# Altium schematic sheet INA226 Current Sensor.SchDoc: INA381A Overcurrent Protection
size Letter; SheetNumber: 21
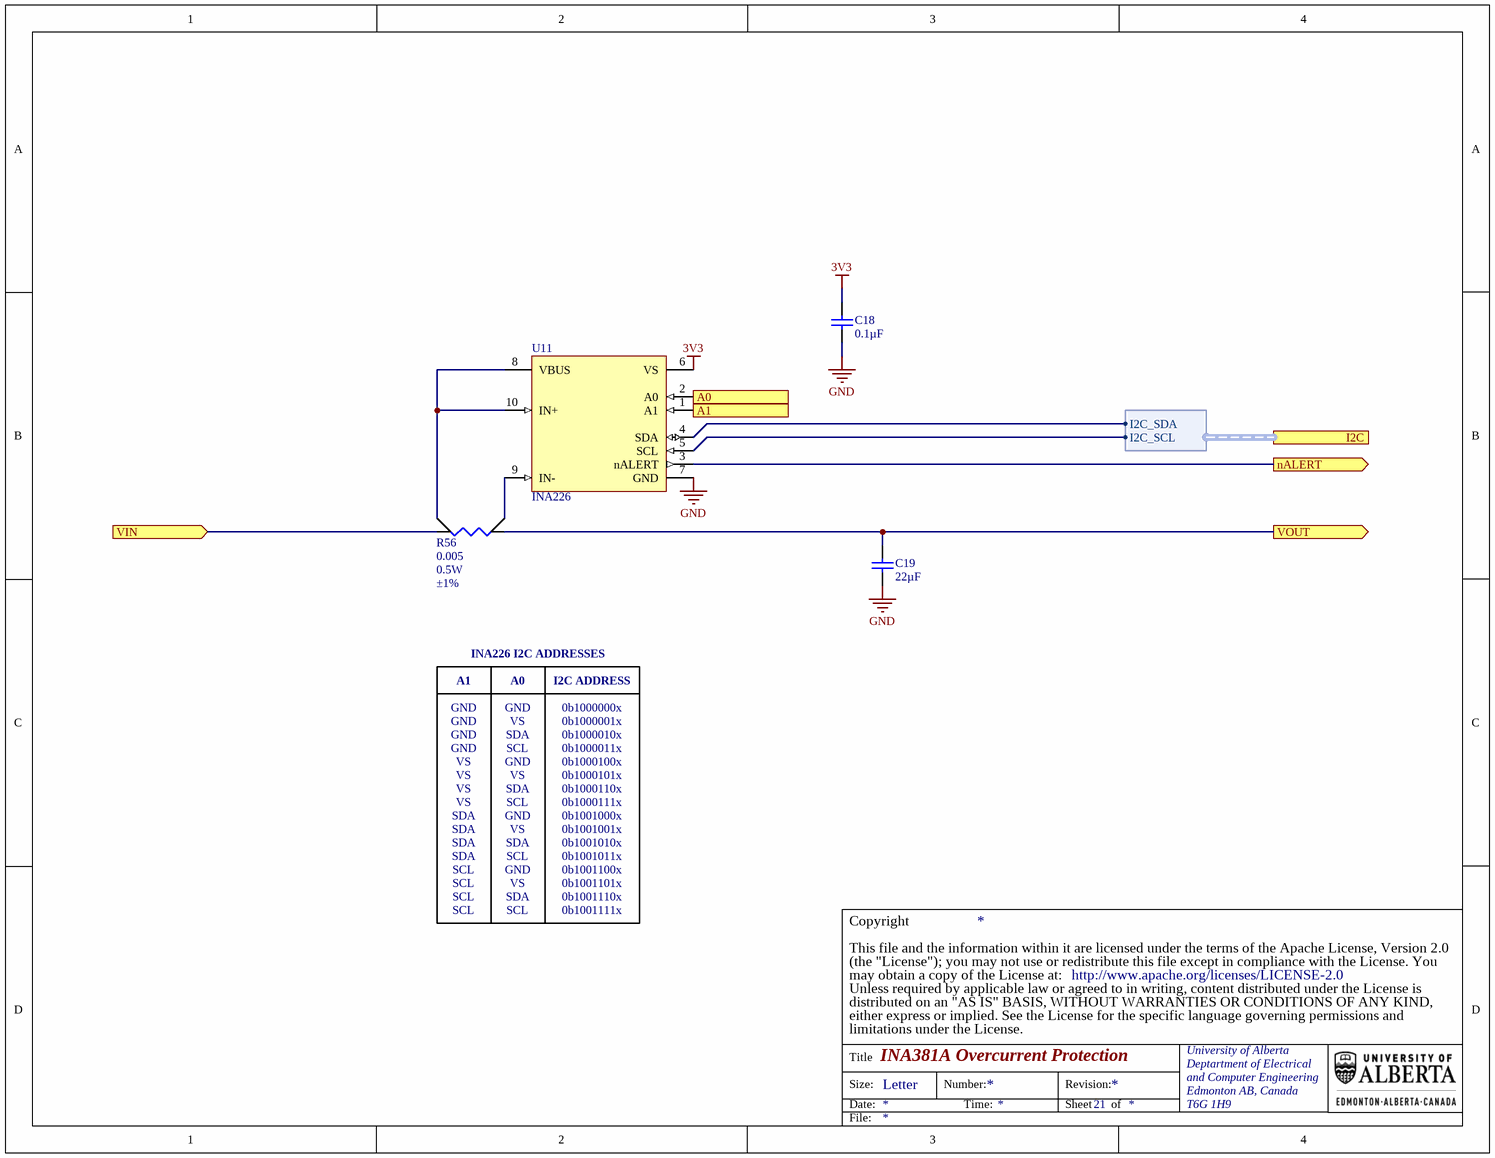
[diagram p0: INA226 Current Sensor.SchDoc]

## Parts
C18  value 0.1µF  [TDK-CGA2B]  (hidden comment: Cap)
C19  value 22µF  [TDK-C3225]  (hidden comment: Cap)
R56  value 0.005  Power - Rated: 0.5W  Tolerance: ±1%  [BRN-CRF0805]  (hidden comment: Res Sense)
U11  INA226  [TI-DGS]

## Ports
A0 (in), A1 (in), I2C (harness INA226_I2C), nALERT (out), VIN (in), VOUT (out)

## Harnesses
INA226_I2C: I2C_SCL, I2C_SDA

## Nets
3V3: C18.2 U11.6(VS)
GND: C18.1 C19.1 U11.7(GND)
A0: U11.2(A0) ; port A0
A1: U11.1(A1) ; port A1
nALERT: U11.3(nALERT) ; port nALERT
VIN: R56.2(I2) ; port VIN
VOUT: C19.2 R56.1(I1) ; port VOUT
NetR56_3: R56.3(S2) U11.8(VBUS) U11.10(IN+)
NetR56_4: R56.4(S1) U11.9(IN-)
NetU11_4: U11.4(SDA) ; port I2C.I2C_SDA
NetU11_5: U11.5(SCL) ; port I2C.I2C_SCL

## Notes on the sheet
- A1
- GND
- A0
- INA226 I2C ADDRESSES
- I2C ADDRESS
- 0b1000000x
- VS
- SDA
- SCL
- 0b1000001x
- 0b1000010x
- 0b1000011x
- 0b1000100x
- 0b1000101x
- 0b1000110x
- 0b1000111x
- 0b1001000x
- 0b1001001x
- 0b1001010x
- 0b1001011x
- 0b1001100x
- 0b1001101x
- 0b1001110x
- 0b1001111x
- (the "License"); you may not use or redistribute this file except in compliance with the License. You
- This file and the information within it are licensed under the terms of the Apache License, Version 2.0
- Copyright
- Unless required by applicable law or agreed to in writing, content distributed under the License is
- distributed on an "AS IS" BASIS, WITHOUT WARRANTIES OR CONDITIONS OF ANY KIND,
- either express or implied. See the License for the specific language governing permissions and
- limitations under the License.
- may obtain a copy of the License at:
- http://www.apache.org/licenses/LICENSE-2.0
- Title
- Size:
- Date:
- Letter
- Number:
- Time:
- Revision:
- Sheet
- of
- University of Alberta
- Deptartment of Electrical
- and Computer Engineering
- Edmonton AB, Canada
- T6G 1H9
- File:

## Library data of the parts
C18 = PC-TDK-02259: CAP CER 0.1UF 50V X7R 0402; Manufacturer Part Number: CGA2B3X7R1H104K050BB; Index: 2259; Designator: C?; Tolerance: ±10%; Published: 2016-03-16; LatestRevisionDate: 2016-03-16; LatestRevisionNote: ...; PackageReference: 0402 (1005 Metric); Publisher: AlbertaSat; PackageDescription: Radial Cap, Thru-Hole; 2 Leads; 0.3 in Pin Spacing; Part Number: PC-TDK-02259; Supplier Part Number 1: 445-6899-1-ND; Supplier 1: Digi-key; Supplier Link: http://www.digikey.ca/product-search/en?keywords=445-6899-1-ND; Voltage - Rated: 50V; Temperature Coefficient: X7R; Applications: Automotive; Operating Temperature: -55°C ~ 125°C
C19 = PC-TDK-02965: CAP CER 22UF 25V X7R 1210; Manufacturer Part Number: C3225X7R1E226M250AB; Index: 2965; Designator: C?; Tolerance: ±20%; Code_IEC: 3225; Published: 2022-10-26; LatestRevisionDate: 2022-10-26; LatestRevisionNote: ...; PackageReference: 1210 (3225 Metric); Publisher: AlbertaSat; PackageDescription: Chip Capacitor, 2-Leads, Body 3.20x2.50mm, IPC Low Density; Part Number: PC-TDK-02965; Supplier Part Number 1: 445-181602-1-ND; Supplier 1: Digi-key; Supplier Part Number 2: 810-C3225X7R1EM250AB; Supplier 2: Mouser; Supplier Link: #https://www.digikey.ca/en/products/detail/tdk-corporation/C3225X7R1E226M250AB/9991387#; Voltage - Rated: 25V; Temperature Coefficient: X7R; Applications: General Purpose; Code_JEITA: 1210; Operating Temperature: -55°C ~ 125°C
R56 = PR-BRN-00023: RES 0.005 OHM 1% 1/2W 0805; Manufacturer Part Number: CRF0805-FZ-R005ELF; Index: 23; Designator: R?; Temperature Coefficient: ±50ppm/°C; Part Number: PR-BRN-00023; Supplier Part Number 1: CRF0805-FZ-R005ELFCT-ND; Supplier 1: Digi-key; Supplier Part Number 2: 652-CRF0805FZR005ELF; Supplier 2: Mouser; Publisher: AlbertaSat; Published: 2022-11-26; LatestRevisionDate: 2023-05-04; LatestRevisionNote: Added operating temperature; PackageReference: BRN-CRF0805; Supplier Link: #https://www.digikey.ca/en/products/detail/bourns-inc/CRF0805-FZ-R005ELF/6210977#; Operating Temperature: -55°C ~ 170°C
U11 = 19: IC MONITOR PWR/CURR BIDIR 10MSOP; Part Number: 19; Manufacturer Part Number: INA226AQDGSRQ1; Designator: U?; Supplier Part Number 2: 595-INA226AQDGSRQ1; Supplier 2: Mouser; Supplier Part Number 1: 296-42503-1-ND; Supplier 1: Digi-Key; Supplier Link: #https://www.digikey.com/product-detail/en/texas-instruments/INA226AQDGSRQ1/296-42503-1-ND/5416001#; PackageReference: TI-MSOP10; Operating Temperature: -40°C ~ 125°C